# Altium schematic sheet vga&audio.SchDoc
size 431 x 228 mm; SheetNumber: 2; SheetTotal: 2
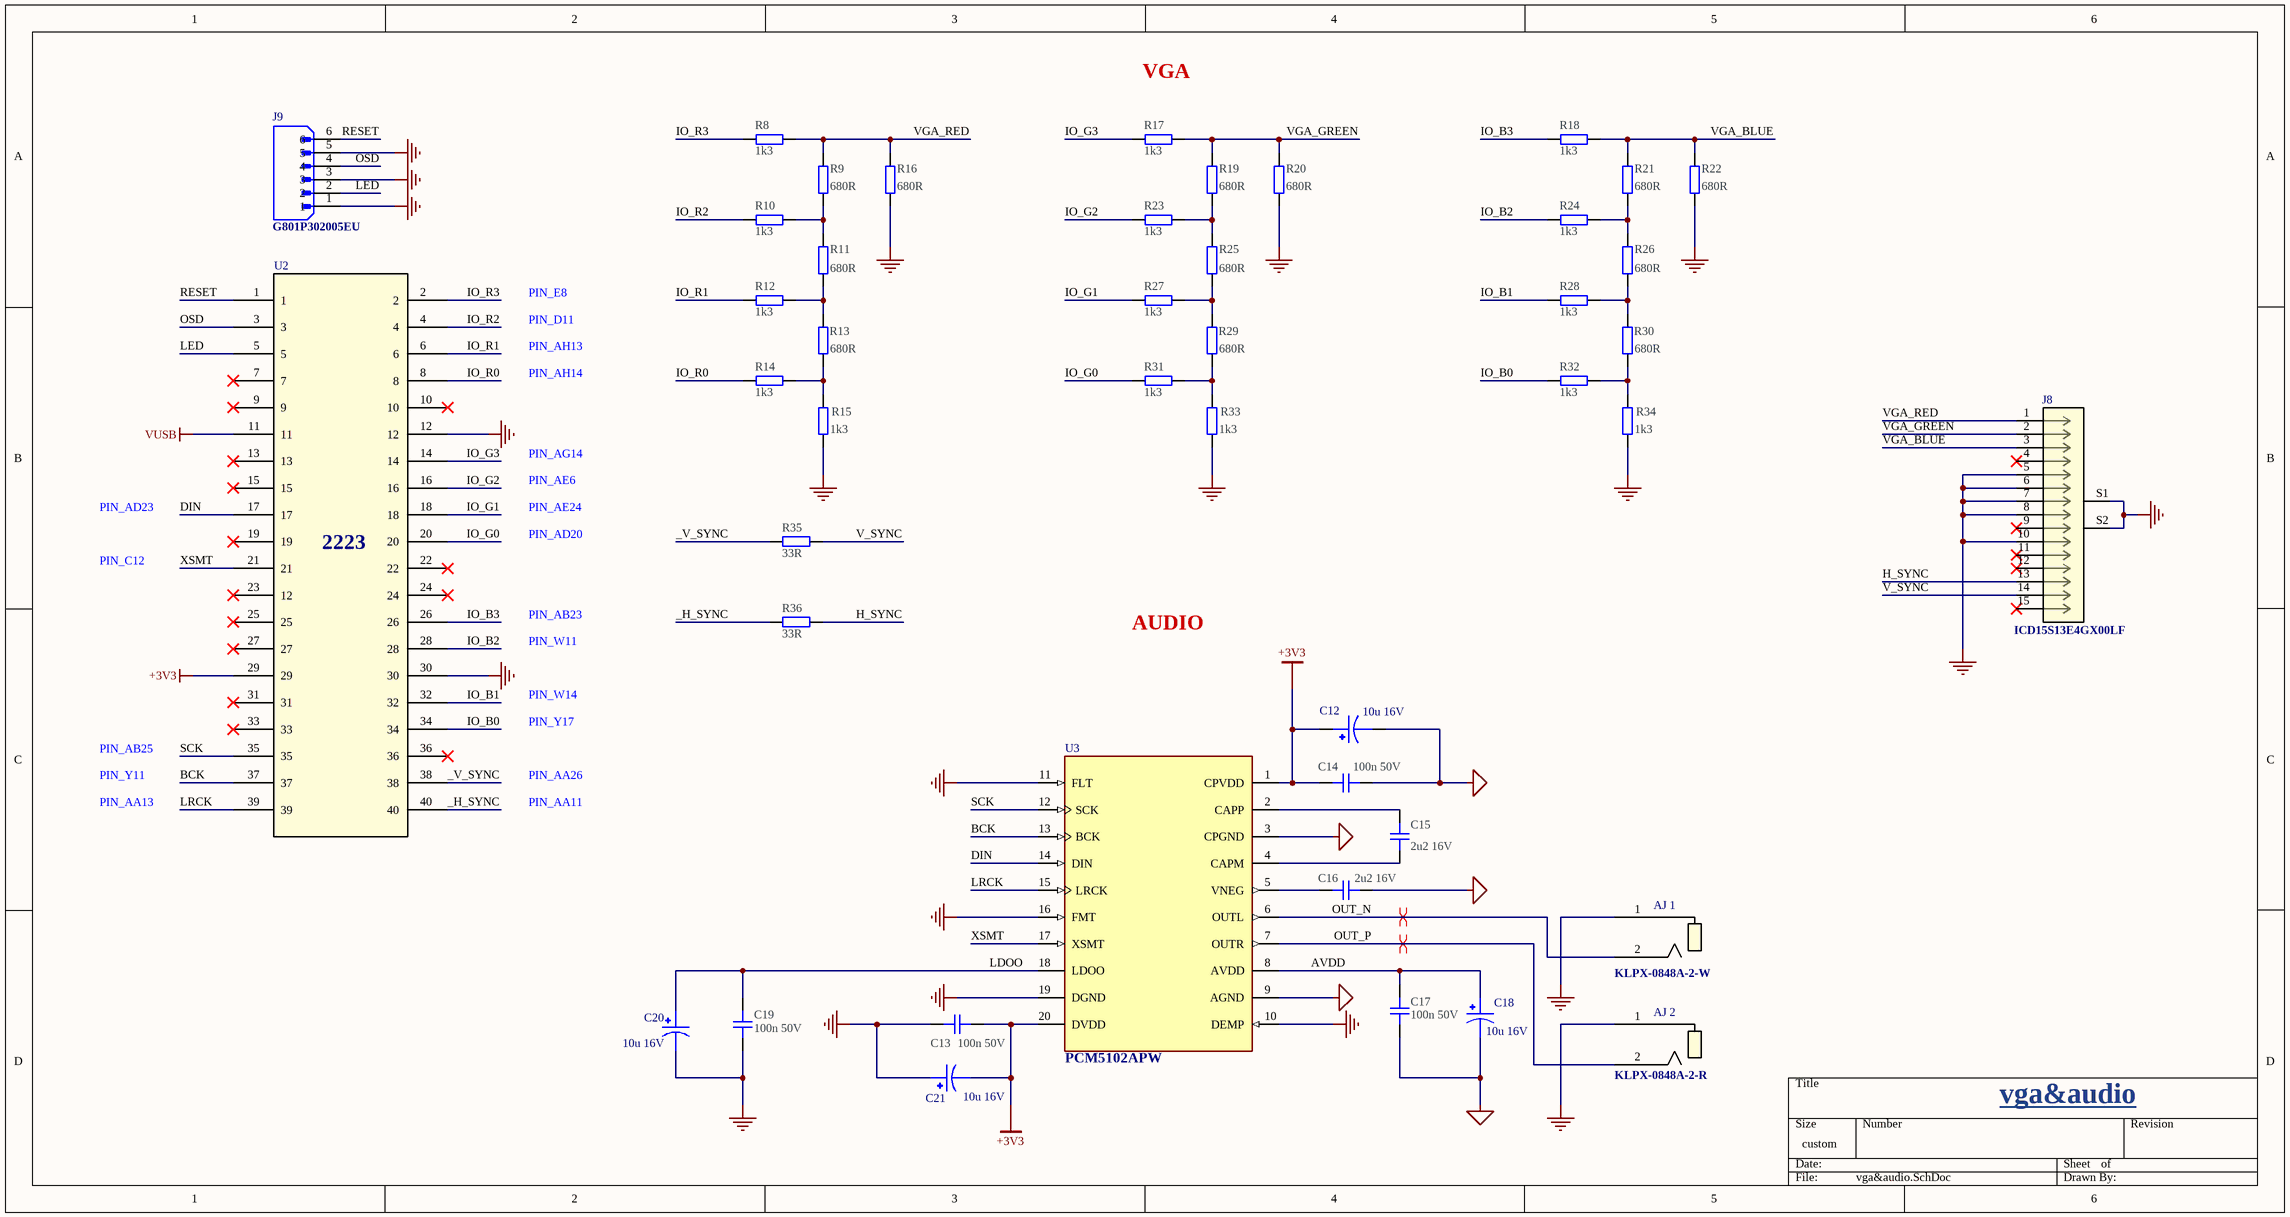
[diagram p0: vga&audio.SchDoc]

## Parts
AJ_1  KLPX-0848A-2-W  [KLPX0848A2W]
AJ_2  KLPX-0848A-2-R  [KLPX0848A2R]
C12  10u 16V  [CAPMP3216X180N]
C13  100n 50V  [CAPC1005X04L]
C14  100n 50V  [CAPC1005X04L]
C15  2u2 16V  [CAPC1005X04L]
C16  2u2 16V  [CAPC1005X04L]
C17  100n 50V  [CAPC1005X04L]
C18  10u 16V  [CAPMP3216X180N]
C19  100n 50V  [CAPC1005X04L]
C20  10u 16V  [CAPMP3216X180N]
C21  10u 16V  [CAPMP3216X180N]
J8  ICD15S13E4GX00LF  [AMPHENOL_ICD15S13E4GX00LF]
J9  G801P302005EU  [AMPHENOL_G801P302005EU]
R8  1k3  [RESC1005X04L]
R9  680R  [RESC1005X04L]
R10  1k3  [RESC1005X04L]
R11  680R  [RESC1005X04L]
R12  1k3  [RESC1005X04L]
R13  680R  [RESC1005X04L]
R14  1k3  [RESC1005X04L]
R15  1k3  [RESC1005X04L]
R16  680R  [RESC1005X04L]
R17  1k3  [RESC1005X04L]
R18  1k3  [RESC1005X04L]
R19  680R  [RESC1005X04L]
R20  680R  [RESC1005X04L]
R21  680R  [RESC1005X04L]
R22  680R  [RESC1005X04L]
R23  1k3  [RESC1005X04L]
R24  1k3  [RESC1005X04L]
R25  680R  [RESC1005X04L]
R26  680R  [RESC1005X04L]
R27  1k3  [RESC1005X04L]
R28  1k3  [RESC1005X04L]
R29  680R  [RESC1005X04L]
R30  680R  [RESC1005X04L]
R31  1k3  [RESC1005X04L]
R32  1k3  [RESC1005X04L]
R33  1k3  [RESC1005X04L]
R34  1k3  [RESC1005X04L]
R35  33R  [RESC1005X04L]
R36  33R  [RESC1005X04L]
U2  2223  [2223_ADA]
U3  PCM5102APW  [SOP65P640X120-20N]

## Nets
+3V3: C12.1 C13.1 C14.2 C21.2 U2.29 U3.1(CPVDD) U3.20(DVDD)
AGND: C12.2 C14.1 C16.2 C17.2 C18.2 U3.3(CPGND) U3.9(AGND)
GND: AJ_1.1 AJ_2.1 C13.2 C19.2 C20.2 C21.1 J8.5 J8.6 J8.7 J8.8 J8.10 J8.S1(SHIELD) J8.S2(SHIELD) J9.1 J9.3 J9.5 R15.2 R16.1 R20.1 R22.1 R33.2 R34.2 U2.12 U2.30 U3.10(DEMP) U3.11(FLT) U3.16(FMT) U3.19(DGND)
VUSB: U2.11
_H_SYNC: R36.1 U2.40
_V_SYNC: R35.1 U2.38
AVDD: C17.1 C18.1 U3.8(AVDD)
BCK: U2.37 U3.13(BCK)
DIN: U2.17 U3.14(DIN)
H_SYNC: J8.13 R36.2
IO_B0: R32.1 U2.34
IO_B1: R28.1 U2.32
IO_B2: R24.1 U2.28
IO_B3: R18.1 U2.26
IO_G0: R31.1 U2.20
IO_G1: R27.1 U2.18
IO_G2: R23.1 U2.16
IO_G3: R17.1 U2.14
IO_R0: R14.1 U2.8
IO_R1: R12.1 U2.6
IO_R2: R10.1 U2.4
IO_R3: R8.1 U2.2
LDOO: C19.1 C20.1 U3.18(LDOO)
LED: J9.2 U2.5
LRCK: U2.39 U3.15(LRCK)
OSD: J9.4 U2.3
OUT_N: AJ_1.2 U3.6(OUTL)
OUT_P: AJ_2.2 U3.7(OUTR)
RESET: J9.6 U2.1
SCK: U2.35 U3.12(SCK)
V_SYNC: J8.14 R35.2
VGA_BLUE: J8.3 R18.2 R21.2 R22.2
VGA_GREEN: J8.2 R17.2 R19.2 R20.2
VGA_RED: J8.1 R8.2 R9.2 R16.2
XSMT: U2.21 U3.17(XSMT)
NetC15_1: C15.1 U3.2(CAPP)
NetC15_2: C15.2 U3.4(CAPM)
NetC16_1: C16.1 U3.5(VNEG)
NetR9_1: R9.1 R10.2 R11.2
NetR11_1: R11.1 R12.2 R13.2
NetR13_1: R13.1 R14.2 R15.1
NetR19_1: R19.1 R23.2 R25.2
NetR21_1: R21.1 R24.2 R26.2
NetR25_1: R25.1 R27.2 R29.2
NetR26_1: R26.1 R28.2 R30.2
NetR29_1: R29.1 R31.2 R33.1
NetR30_1: R30.1 R32.2 R34.1

Not connected (* = marked no-connect by the designer): J8 4* 9* 11* 12* 15*; U2 7* 9* 10* 13* 15* 19* 22* 23(12)* 24* 25* 27* 31* 33* 36*

## Layout directives
differential pair: OUT_N, OUT_P

## Notes on the sheet
- VGA
- PIN_E8
- PIN_D11
- PIN_AH13
- PIN_AH14
- PIN_AG14
- PIN_AE6
- PIN_C12
- PIN_AD23
- PIN_AE24
- PIN_AD20
- PIN_AB23
- AUDIO
- PIN_W11
- PIN_W14
- PIN_AB25
- PIN_Y17
- PIN_AA13
- PIN_Y11
- PIN_AA26
- PIN_AA11
- vga&audio

## Library data of the parts
AJ_1 = KLPX-0848A-2-W: Description; Manufacturer_Name: KYCON, INC.; Manufacturer_Part_Number: KLPX-0848A-2-R; Copyright: Copyright (C) 2025 Ultra Librarian. All rights reserved.; RefDes: RefDes; Type: Type
AJ_2 = KLPX-0848A-2-R: Description; Manufacturer_Name: KYCON, INC.; Copyright: Copyright (C) 2025 Ultra Librarian. All rights reserved.; Manufacturer_Part_Number: KLPX-0848A-2-R; RefDes: RefDes; Type: Type
C12 C18 C20 C21 = TAJA106K016RNJ: 10 ÂµF Molded Tantalum Capacitors 16 V 1206 (3216 Metric) 3Ohm; MF: KYOCERA AVX; SnapEDA_Link: https://www.snapeda.com/parts/TAJA106K016RNJ/Kyocera/view-part/?ref=snap; Package: Package; Value: *; MP: TAJA106K016RNJ; Check_prices: https://www.snapeda.com/parts/TAJA106K016RNJ/Kyocera/view-part/?ref=eda
C13-C17 C19 = C0402-4µ7: Capacitor, X5R, ±20%; Manufacturer: N.A.; Part number IPS: 00000001251, 00000007165; Part number NEMS: 100200193; Value: 4.7µF; Note: 10V; Artikkelnr Noca: 20039482; Pad Count: 2; Component Status: Active; Part Number: C0402-4µ7; Manufacturer Part Number: N.A.; ComponentLink1URL: N.A.; ComponentLink1Description: Datasheet; ComponentLink2URL: N.A.; ComponentLink2Description: Supplier link; HelpURL: N.A.; Footprint Doc: 0402; LatestRevisionDate: 2017-11-09; Published: 2009-05-08; Supplier 1: Digi-Key; Supplier Part Number 1: 490-13252-1-ND; Supplier 2: N.A.; Supplier Part Number 2: N.A.; PartId: 100200193; Component Class: Capacitors; Author: rsk; Part number Norautron: N.A.
J8 = ICD15S13E4GX00LF: Conn High Density D-Sub SKT 15 POS 2.28mm Solder RA Thru-Hole 15 Terminal 1 Port; MF: Amphenol; Package: None; Price: None; Check_prices: https://www.snapeda.com/parts/ICD15S13E4GX00LF/LC/view-part/?ref=eda; Value: *; SnapEDA_Link: https://www.snapeda.com/parts/ICD15S13E4GX00LF/LC/view-part/?ref=snap; MP: ICD15S13E4GX00LF; Availability: In Stock; Purchase-URL: https://pricing.snapeda.com/search?q=ICD15S13E4GX00LF&ref=eda
J9 = G801P302005EU: MF: {'manufacturer': u'Amphenol ICC (Commercial Products)'}; Package: None; Price: None; Value: *; MP: G801P302005EU; Availability: Unavailable
R8-R36 = R0402-0R: Resistor, ±5%, 0.063W; Manufacturer: N.A.; Part number IPS: 00000007128; Part number NEMS: 100100109; Value: 0R; Note: Chip Res 5%; Artikkelnr Noca: 27049000; Pad Count: 2; Component Status: Active; Part Number: R0402-0R; Manufacturer Part Number: N.A.; ComponentLink1URL: N.A.; ComponentLink1Description: Datasheet; ComponentLink2URL: N.A.; ComponentLink2Description: Supplier link; HelpURL: N.A.; Footprint Doc: 0402; LatestRevisionDate: 2009-11-23; Published: 2009-05-08; Supplier 1: Farnell; Supplier Part Number 1: 146-9661; Supplier 2: N.A.; Supplier Part Number 2: N.A.; PartId: 100100109; Component Class: Resistors; Author: rsk; Part number Norautron: N.A.
U2 = 2223: Description; Manufacturer_Name: Adafruit Industries; Copyright: Copyright (C) 2025 Ultra Librarian. All rights reserved.; Manufacturer_Part_Number: 2223; RefDes: RefDes; Type: Type
U3 = PCM5102APW: 2VRMS DirectPathâ„¢, DAC estÃ©reo de Ã¡udio de 112dB com interface PCM de 32 bits e 384kHz 20-TSSOP -25 a 85; MF: Texas Instruments; Purchase-URL: https://pricing.snapeda.com/search/part/PCM5102APW/?ref=eda; MP: PCM5102APW; Value: *; Availability: In Stock; Check_prices: https://www.snapeda.com/parts/PCM5102APW/Texas+Instruments/view-part/?ref=eda; SnapEDA_Link: https://www.snapeda.com/parts/PCM5102APW/Texas+Instruments/view-part/?ref=snap; Price: None; Package: TSSOP-20 Texas Instruments